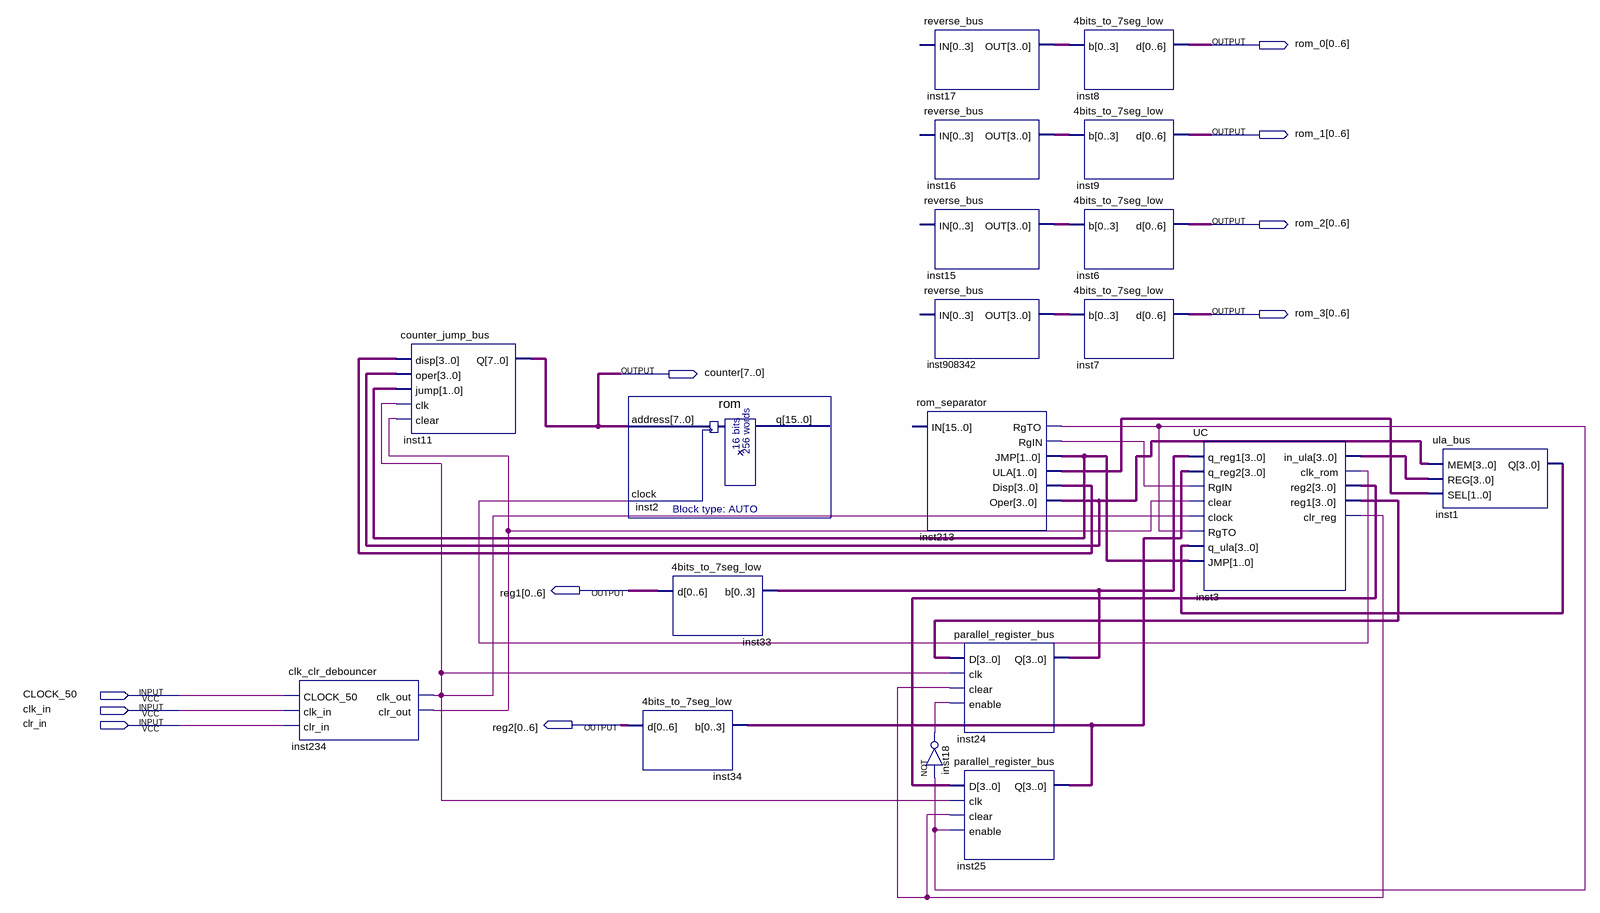
[diagram p0: schematic sheet]
// Quartus schematic cpu.bdf as structural Verilog: 19 symbols, 10 pins
module cpu (
  input  CLOCK_50,
  input  clk_in,
  input  clr_in,
  output [0:6] rom_0,
  output [0:6] rom_1,
  output [0:6] rom_2,
  output [0:6] rom_3,
  output [7:0] counter,
  output [0:6] reg1,
  output [0:6] reg2
);

  wire inst3_clk_rom, inst3_clr_reg, inst18_out, inst213_rgin, inst213_rgto, inst234_clk_out, inst234_clr_out;
  wire [1:0] inst213_jmp, inst213_ula;
  wire [3:0] inst1_q, inst3_in_ula, inst3_reg1, inst3_reg2, inst15_out, inst16_out, inst17_out, inst24_q,
       inst25_q, inst213_disp, inst213_oper, inst908342_out;

  clk_clr_debouncer inst234 (
    .CLOCK_50(CLOCK_50), .clk_in(clk_in), .clr_in(clr_in), .clk_out(inst234_clk_out),
    .clr_out(inst234_clr_out));
  counter_jump_bus inst11 (
    .disp(inst213_disp), .oper(inst213_oper), .jump(inst213_jmp), .clk(inst234_clk_out),
    .clear(inst234_clr_out), .Q(counter));
  rom inst2 (.address(counter), .clock(inst3_clk_rom));  // open: q
  \4bits_to_7seg_low  inst33 (.b(inst24_q), .d(reg1));
  \4bits_to_7seg_low  inst34 (.b(inst25_q), .d(reg2));
  reverse_bus inst17 (.OUT(inst17_out));  // open: IN
  reverse_bus inst16 (.OUT(inst16_out));  // open: IN
  reverse_bus inst15 (.OUT(inst15_out));  // open: IN
  reverse_bus inst908342 (.OUT(inst908342_out));  // open: IN
  rom_separator inst213 (
    .RgTO(inst213_rgto), .RgIN(inst213_rgin), .JMP(inst213_jmp), .ULA(inst213_ula), .Disp(inst213_disp),
    .Oper(inst213_oper));  // open: IN
  not inst18 (inst18_out, inst213_rgto);
  parallel_register_bus inst24 (
    .D(inst3_reg1), .clk(inst234_clk_out), .clear(inst3_clr_reg), .enable(inst18_out), .Q(inst24_q));
  parallel_register_bus inst25 (
    .D(inst3_reg2), .clk(inst234_clk_out), .clear(inst3_clr_reg), .enable(inst213_rgto), .Q(inst25_q));
  \4bits_to_7seg_low  inst8 (.b(inst17_out), .d(rom_0));
  \4bits_to_7seg_low  inst9 (.b(inst16_out), .d(rom_1));
  \4bits_to_7seg_low  inst6 (.b(inst15_out), .d(rom_2));
  \4bits_to_7seg_low  inst7 (.b(inst908342_out), .d(rom_3));
  UC inst3 (
    .q_reg1(inst24_q), .q_reg2(inst25_q), .RgIN(inst213_rgin), .clear(inst234_clr_out),
    .clock(inst234_clk_out), .RgTO(inst213_rgto), .q_ula(inst1_q), .JMP(inst213_jmp), .in_ula(inst3_in_ula),
    .clk_rom(inst3_clk_rom), .reg2(inst3_reg2), .reg1(inst3_reg1), .clr_reg(inst3_clr_reg));
  ula_bus inst1 (.MEM(inst213_oper), .REG(inst3_in_ula), .SEL(inst213_ula), .Q(inst1_q));
endmodule
